# Altium schematic sheet pmic_tps65263_buck.SchDoc
size B
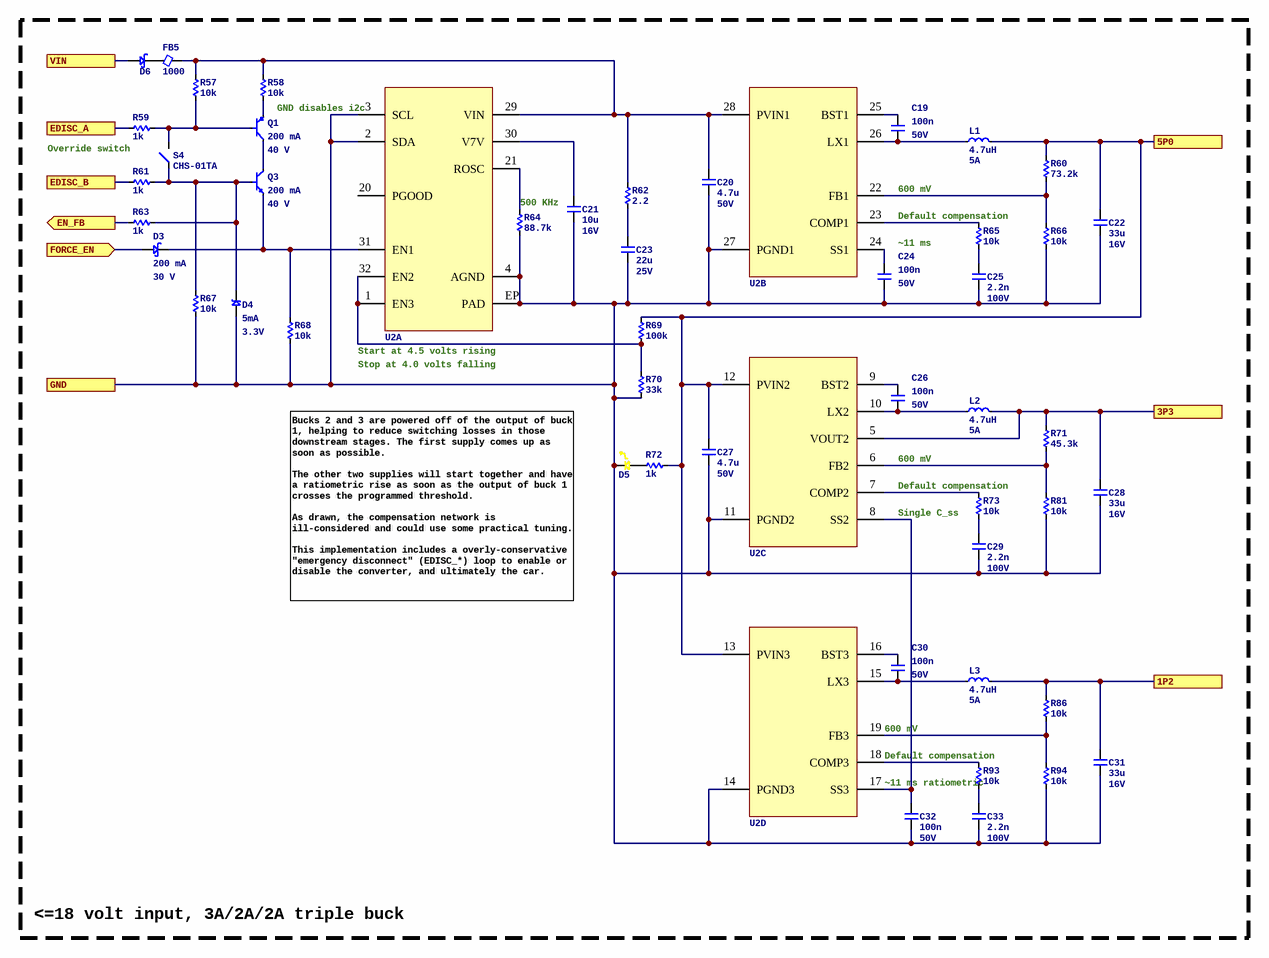
[diagram p0: pmic_tps65263_buck.SchDoc]

## Parts
C19  Capacitance: 100n  Voltage Rating: 50V  [C0402]  (hidden comment: CL05B104KB54PNC)
C20  Capacitance: 4.7u  Voltage Rating: 50V  [C0805]  (hidden comment: 0805B475K500NT)
C21  Capacitance: 10u  Voltage Rating: 16V  [C0805]  (hidden comment: CL21B106KOQNNNE)
C22  Capacitance: 33u  Voltage Rating: 16V  [C1812]  (hidden comment: C4532X7R1C336MT000N)
C23  Capacitance: 22u  Voltage Rating: 25V  [C2220]  (hidden comment: C5750X7R1E226MT000N)
C24  Capacitance: 100n  Voltage Rating: 50V  [C0402]  (hidden comment: CL05B104KB54PNC)
C25  Capacitance: 2.2n  Voltage Rating: 100V  [C0402]  (hidden comment: CC0402KRX7R0BB222)
C26  Capacitance: 100n  Voltage Rating: 50V  [C0402]  (hidden comment: CL05B104KB54PNC)
C27  Capacitance: 4.7u  Voltage Rating: 50V  [C0805]  (hidden comment: 0805B475K500NT)
C28  Capacitance: 33u  Voltage Rating: 16V  [C1812]  (hidden comment: C4532X7R1C336MT000N)
C29  Capacitance: 2.2n  Voltage Rating: 100V  [C0402]  (hidden comment: CC0402KRX7R0BB222)
C30  Capacitance: 100n  Voltage Rating: 50V  [C0402]  (hidden comment: CL05B104KB54PNC)
C31  Capacitance: 33u  Voltage Rating: 16V  [C1812]  (hidden comment: C4532X7R1C336MT000N)
C32  Capacitance: 100n  Voltage Rating: 50V  [C0402]  (hidden comment: CL05B104KB54PNC)
C33  Capacitance: 2.2n  Voltage Rating: 100V  [C0402]  (hidden comment: CC0402KRX7R0BB222)
D3  Current: 200 mA  Voltage: 30 V  [SOD523]  (hidden comment: BAT54XV2T1G)
D4  Current: 5mA  Voltage: 3.3V  [SOD523]  (hidden comment: SZMM5Z3V3T1G)
D5  LTST-C190YKT  [LED_0603P_YELLOW]  (value not drawn)
D6  B340A-13-F  [SMA]  (value not drawn)
FB5  Current Rating (mA): 1000  [FB0805]  (hidden comment: HCB2012KF-102T10)
L1  value 4.7uH  Current: 5A  [SMD-4.1x4.1x2.0]  (hidden comment: FTC404020S4R7MGCA)
L2  value 4.7uH  Current: 5A  [SMD-4.1x4.1x2.0]  (hidden comment: FTC404020S4R7MGCA)
L3  value 4.7uH  Current: 5A  [SMD-4.1x4.1x2.0]  (hidden comment: FTC404020S4R7MGCA)
Q1  Current: 200 mA  Voltage: 40 V  [3SOT523]  (hidden comment: MMBT3906T)
Q3  Current: 200 mA  Voltage: 40 V  [3SOT523]  (hidden comment: MMBT3904T)
R57  value 10k  [R0402]  (hidden comment: 0402WGF1002TCE)
R58  value 10k  [R0402]  (hidden comment: 0402WGF1002TCE)
R59  value 1k  [R0402]  (hidden comment: 0402WGF1001TCE)
R60  value 73.2k  [R0402]  (hidden comment: 0402WGF7322TCE)
R61  value 1k  [R0402]  (hidden comment: 0402WGF1001TCE)
R62  value 2.2  [R0805]  (hidden comment: HP05W3F220KT5E)
R63  value 1k  [R0402]  (hidden comment: 0402WGF1001TCE)
R64  value 88.7k  [R0402]  (hidden comment: 0402WGF8872TCE)
R65  value 10k  [R0402]  (hidden comment: 0402WGF1002TCE)
R66  value 10k  [R0402]  (hidden comment: 0402WGF1002TCE)
R67  value 10k  [R0402]  (hidden comment: 0402WGF1002TCE)
R68  value 10k  [R0402]  (hidden comment: 0402WGF1002TCE)
R69  value 100k  [R0402]  (hidden comment: 0402WGF1003TCE)
R70  value 33k  [R0402]  (hidden comment: 0402WGF3302TCE)
R71  value 45.3k  [R0402]  (hidden comment: FRC0402F4532TS)
R72  value 1k  [R0402]  (hidden comment: 0402WGF1001TCE)
R73  value 10k  [R0402]  (hidden comment: 0402WGF1002TCE)
R81  value 10k  [R0402]  (hidden comment: 0402WGF1002TCE)
R86  value 10k  [R0402]  (hidden comment: 0402WGF1002TCE)
R93  value 10k  [R0402]  (hidden comment: 0402WGF1002TCE)
R94  value 10k  [R0402]  (hidden comment: 0402WGF1002TCE)
S4  CHS-01TA  [SWITCH_NIDEC_CHS-01TA]
U2  TPS65263QRHBRQ1  [TI_RHB]  (value not drawn)  (parts A,B,C,D of 4)

## Ports
1P2, 3P3, 5P0, EDISC_A, EDISC_B, EN_FB (out), FORCE_EN (in), GND, VIN

## Nets
1P2: C31.1 L3.2 R86.2 ; port 1P2
3P3: C28.1 L2.2 R71.2 U2.5(VOUT2) ; port 3P3
5P0: C22.1 C27.1 L1.2 R60.2 R69.2 R72.2 U2.12(PVIN2) U2.13(PVIN3) ; port 5P0
EDISC_A: R59.1 ; port EDISC_A
EDISC_B: R61.1 ; port EDISC_B
EN_FB: R63.1 ; port EN_FB
FORCE_EN: D3.1 ; port FORCE_EN
GND: C20.2 C21.2 C22.2 C23.2 C24.2 C25.2 C27.2 C28.2 C29.2 C31.2 C32.2 C33.2 D4.1 D5.1 R64.1 R66.1 R67.1 R68.1 R70.1 R81.1 R94.1 U2.2(SDA) U2.3(SCL) U2.4(AGND) U2.11(PGND2) U2.14(PGND3) U2.27(PGND1) U2.EP(PAD) ; port GND
VIN: D6.1 ; port VIN
NetC19_1: C19.1 U2.25(BST1)
NetC19_2: C19.2 L1.1 U2.26(LX1)
NetC20_1: C20.1 FB5.2 R57.2 R58.2 R62.2 U2.28(PVIN1) U2.29(VIN)
NetC21_1: C21.1 U2.30(V7V)
NetC23_1: C23.1 R62.1
NetC24_1: C24.1 U2.24(SS1)
NetC25_1: C25.1 R65.1
NetC26_1: C26.1 U2.9(BST2)
NetC26_2: C26.2 L2.1 U2.10(LX2)
NetC29_1: C29.1 R73.1
NetC30_1: C30.1 U2.16(BST3)
NetC30_2: C30.2 L3.1 U2.15(LX3)
NetC32_1: C32.1 U2.8(SS2) U2.17(SS3)
NetC33_1: C33.1 R93.1
NetD3_2: D3.2 Q3.2(E) R68.2 U2.31(EN1)
NetD4_2: D4.2 Q3.1(B) R61.2 R63.2 R67.2 S4.1
NetD5_2: D5.2 R72.1
NetD6_2: D6.2 FB5.1
NetQ1_1: Q1.1(B) R57.1 R59.2 S4.2
NetQ1_2: Q1.2(E) R58.1
NetQ1_3: Q1.3(C) Q3.3(C)
NetR60_1: R60.1 R66.2 U2.22(FB1)
NetR64_2: R64.2 U2.21(ROSC)
NetR65_2: R65.2 U2.23(COMP1)
NetR69_1: R69.1 R70.2 U2.1(EN3) U2.32(EN2)
NetR71_1: R71.1 R81.2 U2.6(FB2)
NetR73_2: R73.2 U2.7(COMP2)
NetR86_1: R86.1 R94.2 U2.19(FB3)
NetR93_2: R93.2 U2.18(COMP3)

Not connected (* = marked no-connect by the designer): U2 20(PGOOD)

## Notes on the sheet
- Override switch
- GND disables i2c
- (near R64) 500 KHz
- 600 mV
- (near R65) Default compensation
- ~11 ms
- Start at 4.5 volts rising
- Stop at 4.0 volts falling
- (near R73) Default compensation
- Single C_ss
- Bucks 2 and 3 are powered off of the output of buck 1, helping to reduce switching losses in those downstream stages. The first supply comes up as soon as possible.
  The other two supplies will start together and have a ratiometric rise as soon as the output of buck 1 crosses the programmed threshold.
  As drawn, the compensation network is ill-considered and could use some practical tuning.
  This implementation includes a overly-conservative "emergency disconnect" (EDISC_*) loop to enable or disable the converter, and ultimately the car.
- (near U2) 600 mV
- (near R93) Default compensation
- (near R93) ~11 ms ratiometric
- <=18 volt input, 3A/2A/2A triple buck

## Library data of the parts
C19 C24 C26 C30 C32 = CL05B104KB54PNC: Manufacturer: Samsung Electro-Mechanics; Dielectric: X7R; ComponentLink1URL: https://wmsc.lcsc.com/wmsc/upload/file/pdf/v2/lcsc/2304140030_Samsung-Electro-Mechanics-CL05B104KB54PNC_C307331.pdf; ComponentLink1Description: Datasheet; Manufacturer Part Number: CL05B104KB54PNC; Package: 0402; Supplier 2: LCSC; Supplier Part Number 2: C307331
C20 C27 = 0805B475K500NT: Manufacturer: FH (Guangdong Fenghua Advanced Tech); Dielectric: X7R; ComponentLink1URL: https://wmsc.lcsc.com/wmsc/upload/file/pdf/v2/lcsc/2204111630_FH--Guangdong-Fenghua-Advanced-Tech-0805B475K500NT_C2991173.pdf; ComponentLink1Description: Datasheet; Manufacturer Part Number: 0805B475K500NT; Package: 0805; Supplier 2: LCSC; Supplier Part Number 2: C2991173
C21 = CL21B106KOQNNNE: Manufacturer: Samsung Electro-Mechanics; Dielectric: X7R; ComponentLink1URL: https://wmsc.lcsc.com/wmsc/upload/file/pdf/v2/lcsc/2304140030_Samsung-Electro-Mechanics-CL21B106KOQNNNE_C95841.pdf; ComponentLink1Description: Datasheet; Manufacturer Part Number: CL21B106KOQNNNE; Package: 0805; Supplier 2: LCSC; Supplier Part Number 2: C95841
C22 C28 C31 = C4532X7R1C336MT000N: Manufacturer: TDK; Dielectric: X7R; ComponentLink1URL: https://wmsc.lcsc.com/wmsc/upload/file/pdf/v2/lcsc/2304140030_TDK-C4532X7R1C336MT000N_C342604.pdf; ComponentLink1Description: Datasheet; Manufacturer Part Number: C4532X7R1C336MT000N; Package: 1812; Supplier 2: LCSC; Supplier Part Number 2: C342604
C23 = C5750X7R1E226MT000N: Manufacturer: TDK; Dielectric: X7R; ComponentLink1URL: https://wmsc.lcsc.com/wmsc/upload/file/pdf/v2/lcsc/2409291207_TDK-C5750X7R1E226MT000N_C76694.pdf; ComponentLink1Description: Datasheet; Manufacturer Part Number: C5750X7R1E226MT000N; Package: 2220; Supplier 2: LCSC; Supplier Part Number 2: C76694
C25 C29 C33 = CC0402KRX7R0BB222: Manufacturer: YAGEO; Dielectric: X7R; ComponentLink1URL: https://wmsc.lcsc.com/wmsc/upload/file/pdf/v2/lcsc/2211211800_YAGEO-CC0402KRX7R0BB222_C576731.pdf; ComponentLink1Description: Datasheet; Manufacturer Part Number: CC0402KRX7R0BB222; Package: 0402; Supplier 2: LCSC; Supplier Part Number 2: C576731
D3 = SCHOTTKY_30V_BAT54XV2T1G: ON Semi BAT54XV2T1G; SMT Schottky Diode; 30V 200mA; 5ns; 2-Pin SOD-523; Manufacturer: onsemi; Supplier 1: DigiKey; Supplier Part Number 1: BAT54XV2T1GOSCT-ND; Manufacturer Part Number: BAT54XV2T1G; Supplier 2: LCSC; Supplier Part Number 2: C81572
D4 = ZENER_3.3V_SZMM5Z3V3T1G: 500 mW Standard Tolerance Zener Diode Voltage Regulators 3.3 V (Automotive); Manufacturer: onsemi; Supplier 1: DigiKey; Supplier Part Number 1: SZMM5Z3V3T1GOSCT-ND; Manufacturer Part Number: SZMM5Z3V3T1G; ComponentLink1Description: Datasheet; ComponentLink1URL: https://www.onsemi.com/pdf/datasheet/mm5z2v4t1-d.pdf; Supplier 2: LCSC; Supplier Part Number 2: C464127
D5 = LED_0603_YELLOW_LTST-C190YKT: LED YELLOW CLEAR 0603 SMD; Manufacturer: Lite-On Inc; Supplier 1: Digikey; ComponentLink1URL: https://mm.digikey.com/Volume0/opasdata/d220001/medias/docus/1176/LTST-C190YKT.pdf; ComponentLink1Description: Datasheet; Supplier Part Number 1: 160-1184-1-ND; Manufacturer Part Number: LTST-C190YKT; Supplier 2: LCSC; Supplier Part Number 2: C125097
D6 = SCHOTTKY_B340A-13-F: Rectifier Diode, Schottky, 1 Phase, 1 Element, 3A, 40V V(RRM), Silicon; Manufacturer: Diodes; Supplier 1: Digikey; ComponentLink1URL: https://www.diodes.com/assets/Datasheets/ds30891.pdf; Supplier Part Number 1: B340A-FDICT-ND; ComponentLink1Description: Datasheet; Manufacturer Part Number: B340A-13-F; Supplier 2: LCSC; Supplier Part Number 2: C85098
FB5 = HCB2012KF-102T10: Manufacturer: TAI-TECH; DCR (mOhms): 200; ComponentLink1URL: https://wmsc.lcsc.com/wmsc/upload/file/pdf/v2/lcsc/2009171138_TAI-TECH-HCB2012KF-102T10_C356985.pdf; ComponentLink1Description: Datasheet; Manufacturer Part Number: HCB2012KF-102T10; Package: 0805; Z @ 100 MHz: 1000; Supplier 2: LCSC; Supplier Part Number 2: C356985
L1-L3 = IND_4.7UH_FTC404020S4R7MGCA: 5A 4.7uH 6.3A 58mΩ ±20% SMD,4.1x4.1mm Fixed Inductors RoHS; Manufacturer: cjiang; ComponentLink1URL: https://www.lcsc.com/datasheet/C39676072.pdf; ComponentLink1Description: Datasheet; Manufacturer Part Number: FTC404020S4R7MGCA; Supplier 2: LCSC; Supplier Part Number 2: C39676072
Q1 = PNP_40V_MMBT3906T: Bipolar (BJT) Transistor NPN 40 V 200 mA 300MHz 150 mW Surface Mount SOT-523; Manufacturer: Shenzhen Slkormicro Semicon Co., Ltd.; Supplier 1: Digikey; Supplier Part Number 1: 5399-MMBT3906TCT-ND; Manufacturer Part Number: MMBT3906T; Supplier 2: LCSC; Supplier Part Number 2: C61615; ComponentLink1Description: Datasheet; ComponentLink1URL: https://mm.digikey.com/Volume0/opasdata/d220001/medias/docus/7136/5399_MMBT3906T%20SOT-523.pdf
Q3 = NPN_40V_MMBT3904T: Bipolar (BJT) Transistor NPN 40 V 200 mA 300MHz 150 mW Surface Mount SOT-523; Manufacturer: Shenzhen Slkormicro Semicon Co., Ltd.; Supplier 1: Digikey; Supplier Part Number 1: 5399-MMBT3904TCT-ND; Manufacturer Part Number: MMBT3904T; ComponentLink1Description: Datasheet; ComponentLink1URL: https://mm.digikey.com/Volume0/opasdata/d220001/medias/docus/7136/5399_MMBT3904T%20SOT-523.pdf; Supplier 2: LCSC; Supplier Part Number 2: C61616
R57 R58 R65-R68 R73 R81 R86 R93 R94 = 0402WGF1002TCE: Manufacturer: UNI-ROYAL(Uniroyal Elec); Tolerance: 1%; Temperature Coefficient: Â±100ppm/â„ƒ; Power Rating (mW): 62.5; ComponentLink1Description: Datasheet; ComponentLink1URL: https://wmsc.lcsc.com/wmsc/upload/file/pdf/v2/lcsc/2206010100_UNI-ROYAL-Uniroyal-Elec-0402WGF1002TCE_C25744.pdf; Manufacturer Part Number: 0402WGF1002TCE; Package: 0402; Supplier 2: LCSC; Supplier Part Number 2: C25744
R59 R61 R63 R72 = 0402WGF1001TCE: Manufacturer: UNI-ROYAL(Uniroyal Elec); Tolerance: 1%; Temperature Coefficient: Â±100ppm/â„ƒ; Power Rating (mW): 62.5; ComponentLink1Description: Datasheet; ComponentLink1URL: https://wmsc.lcsc.com/wmsc/upload/file/pdf/v2/lcsc/2206010216_UNI-ROYAL-Uniroyal-Elec-0402WGF1001TCE_C11702.pdf; Manufacturer Part Number: 0402WGF1001TCE; Package: 0402; Supplier 2: LCSC; Supplier Part Number 2: C11702
R60 = 0402WGF7322TCE: Manufacturer: UNI-ROYAL(Uniroyal Elec); Tolerance: 1%; Temperature Coefficient: Â±100ppm/â„ƒ; Power Rating (mW): 62.5; ComponentLink1Description: Datasheet; ComponentLink1URL: https://wmsc.lcsc.com/wmsc/upload/file/pdf/v2/lcsc/2206010030_UNI-ROYAL-Uniroyal-Elec-0402WGF7322TCE_C26986.pdf; Manufacturer Part Number: 0402WGF7322TCE; Package: 0402; Supplier 2: LCSC; Supplier Part Number 2: C26986
R62 = HP05W3F220KT5E: Manufacturer: UNI-ROYAL(Uniroyal Elec); Tolerance: 1%; Temperature Coefficient: Â±100ppm/â„ƒ; Power Rating (mW): 333.3; ComponentLink1Description: Datasheet; ComponentLink1URL: https://datasheet.lcsc.com/lcsc/2304140030_UNI-ROYAL-Uniroyal-Elec-HP05W3F220KT5E_C2759317.pdf; Manufacturer Part Number: HP05W3F220KT5E; Package: 0805; Supplier 2: LCSC; Supplier Part Number 2: C2759317
R64 = 0402WGF8872TCE: Manufacturer: UNI-ROYAL(Uniroyal Elec); Tolerance: 1%; Temperature Coefficient: Â±100ppm/â„ƒ; Power Rating (mW): 62.5; ComponentLink1Description: Datasheet; ComponentLink1URL: https://wmsc.lcsc.com/wmsc/upload/file/pdf/v2/lcsc/2206010045_UNI-ROYAL-Uniroyal-Elec-0402WGF8872TCE_C25922.pdf; Manufacturer Part Number: 0402WGF8872TCE; Package: 0402; Supplier 2: LCSC; Supplier Part Number 2: C25922
R69 = 0402WGF1003TCE: Manufacturer: UNI-ROYAL(Uniroyal Elec); Tolerance: 1%; Temperature Coefficient: Â±100ppm/â„ƒ; Power Rating (mW): 62.5; ComponentLink1Description: Datasheet; ComponentLink1URL: https://wmsc.lcsc.com/wmsc/upload/file/pdf/v2/lcsc/2206010100_UNI-ROYAL-Uniroyal-Elec-0402WGF1003TCE_C25741.pdf; Manufacturer Part Number: 0402WGF1003TCE; Package: 0402; Supplier 2: LCSC; Supplier Part Number 2: C25741
R70 = 0402WGF3302TCE: Manufacturer: UNI-ROYAL(Uniroyal Elec); Tolerance: 1%; Temperature Coefficient: Â±100ppm/â„ƒ; Power Rating (mW): 62.5; ComponentLink1Description: Datasheet; ComponentLink1URL: https://wmsc.lcsc.com/wmsc/upload/file/pdf/v2/lcsc/2206010100_UNI-ROYAL-Uniroyal-Elec-0402WGF3302TCE_C25779.pdf; Manufacturer Part Number: 0402WGF3302TCE; Package: 0402; Supplier 2: LCSC; Supplier Part Number 2: C25779
R71 = FRC0402F4532TS: Manufacturer: FOJAN; Tolerance: 1%; Temperature Coefficient: Â±100ppm/â„ƒ; Power Rating (mW): 62.5; ComponentLink1Description: Datasheet; ComponentLink1URL: https://datasheet.lcsc.com/lcsc/2308241947_FOJAN-FRC0402F4532TS_C2933099.pdf; Manufacturer Part Number: FRC0402F4532TS; Package: 0402; Supplier 2: LCSC; Supplier Part Number 2: C2933099
S4 = SWITCH_CHS-01TA: DIP Switch, Slide, SPST, Flush, Recessed, 6VDC, 100mA, CHS Series | Nidec Components CHS-01TA; Manufacturer: Nidec Copal; Supplier 1: Digikey; Supplier Part Number 1: 563-1003-1-ND; Manufacturer Part Number: CHS-01TA; ComponentLink1Description: Datasheet; ComponentLink1URL: https://www.nidec-components.com/e/catalog/switch/chs.pdf; Supplier 2: LCSC; Supplier Part Number 2: C2921603
U2 = BUCK_TPS65263QRHBRQ1: Switching Regulator, Current-mode, 3A, 2300kHz Switching Freq-Max, PQCC32; Manufacturer: Texas Instruments; ComponentLink4URL: https://www.ti.com/lit/ds/symlink/tps65263-q1.pdf; ComponentLink4Description: Datasheet; Supplier 1: Digikey; Supplier Part Number 1: 296-40886-1-ND; Supplier 2: LCSC; Supplier Part Number 2: C2073290; Manufacturer Part Number: TPS65263QRHBRQ1